# Altium schematic sheet LEDs.SchDoc
size A3; SheetNumber: 6; SheetTotal: 6
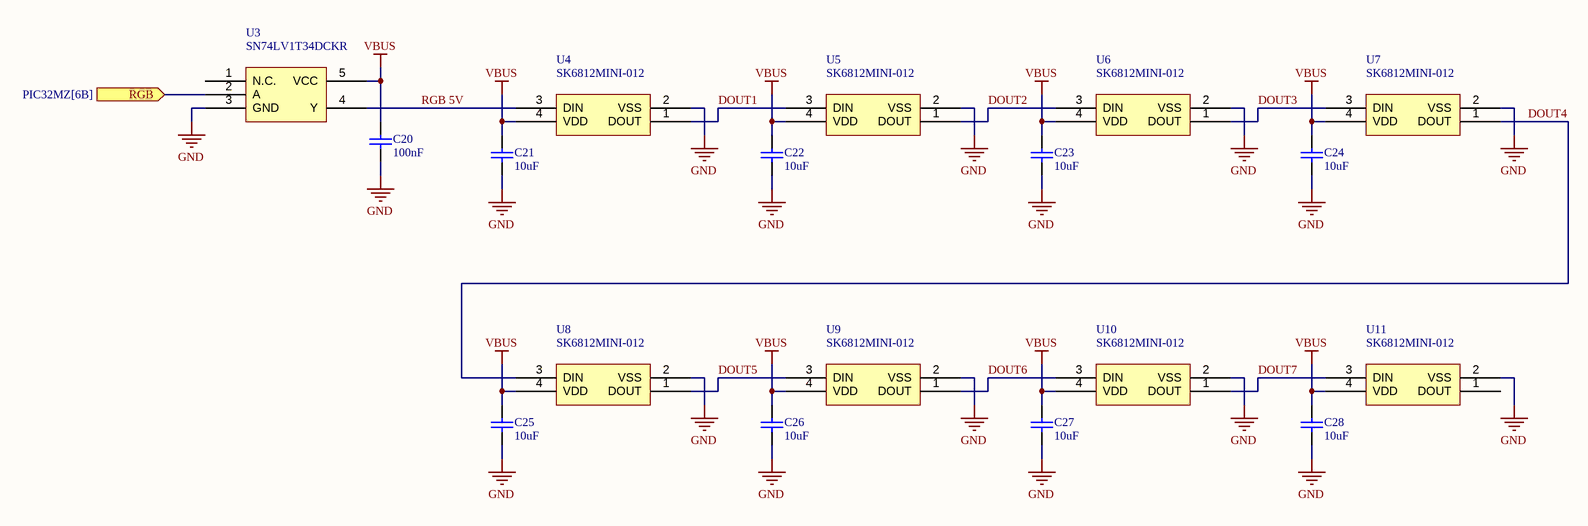
[diagram p0: LEDs.SchDoc]

## Parts
C20  100nF  [Capacitor 0402]
C21  10uF  [Capacitor 0603]
C22  10uF  [Capacitor 0603]
C23  10uF  [Capacitor 0603]
C24  10uF  [Capacitor 0603]
C25  10uF  [Capacitor 0603]
C26  10uF  [Capacitor 0603]
C27  10uF  [Capacitor 0603]
C28  10uF  [Capacitor 0603]
U3  SN74LV1T34DCKR  [SOT-323-5]
U4  SK6812MINI-012  [SK6812MINI-B-012]
U5  SK6812MINI-012  [SK6812MINI-B-012]
U6  SK6812MINI-012  [SK6812MINI-B-012]
U7  SK6812MINI-012  [SK6812MINI-B-012]
U8  SK6812MINI-012  [SK6812MINI-B-012]
U9  SK6812MINI-012  [SK6812MINI-B-012]
U10  SK6812MINI-012  [SK6812MINI-B-012]
U11  SK6812MINI-012  [SK6812MINI-B-012]

## Ports
RGB (in, see PIC32MZ[6B])

## Nets
GND: C20.1 C21.1 C22.1 C23.1 C24.1 C25.1 C26.1 C27.1 C28.1 U3.3(GND) U4.2(VSS) U5.2(VSS) U6.2(VSS) U7.2(VSS) U8.2(VSS) U9.2(VSS) U10.2(VSS) U11.2(VSS)
VBUS: C20.2 C21.2 C22.2 C23.2 C24.2 C25.2 C26.2 C27.2 C28.2 U3.5(VCC) U4.4(VDD) U5.4(VDD) U6.4(VDD) U7.4(VDD) U8.4(VDD) U9.4(VDD) U10.4(VDD) U11.4(VDD)
DOUT1: U4.1(DOUT) U5.3(DIN)
DOUT2: U5.1(DOUT) U6.3(DIN)
DOUT3: U6.1(DOUT) U7.3(DIN)
DOUT4: U7.1(DOUT) U8.3(DIN)
DOUT5: U8.1(DOUT) U9.3(DIN)
DOUT6: U9.1(DOUT) U10.3(DIN)
DOUT7: U10.1(DOUT) U11.3(DIN)
RGB: U3.2(A) ; port RGB
RGB 5V: U3.4(Y) U4.3(DIN)

Not connected (* = marked no-connect by the designer): U3 1(N.C.); U11 1(DOUT)

## Notes on the sheet
- TITLE
- SIZE
- A3
- VARIANT
- PROJECT
- SHEET
- VERSION
- OF
- AUTHOR
- DATE

## Library data of the parts
C20-C28 = Capacitor
U3 = SN74LVC1xxx (1 Input)
U4-U11 = SK6812MINI-B-012